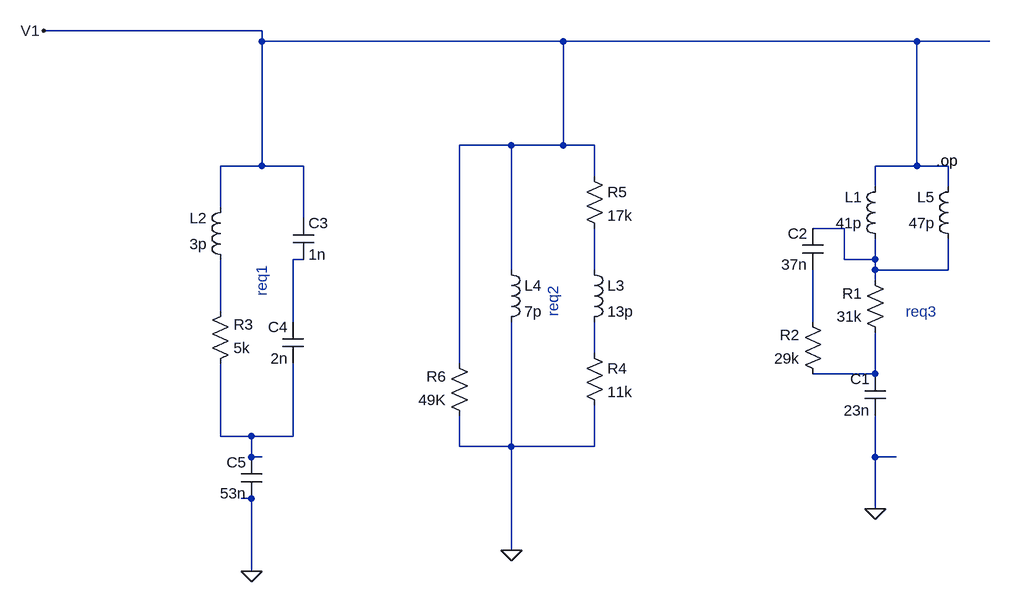
[diagram p0: schematic ejemplo 4.asc]
ejemplo 4.asc, the LTspice schematic file:
Version 4
SHEET 1 1168 680
WIRE -256 -176 -592 -176
WIRE -256 -160 -256 -176
WIRE 208 -160 -256 -160
WIRE 752 -160 208 -160
WIRE 864 -160 752 -160
WIRE 128 0 48 0
WIRE 208 0 208 -160
WIRE 208 0 128 0
WIRE 256 0 208 0
WIRE -256 32 -256 -160
WIRE -256 32 -320 32
WIRE -192 32 -256 32
WIRE 752 32 752 -160
WIRE 752 32 688 32
WIRE 800 32 752 32
WIRE 256 48 256 0
WIRE 688 64 688 32
WIRE 800 64 800 32
WIRE -320 96 -320 32
WIRE -192 112 -192 32
WIRE 640 128 592 128
WIRE -192 176 -208 176
WIRE 640 176 640 128
WIRE 688 176 688 144
WIRE 688 176 640 176
WIRE 128 192 128 0
WIRE 256 192 256 128
WIRE 688 192 688 176
WIRE 800 192 800 144
WIRE 800 192 688 192
WIRE 688 208 688 192
WIRE -320 256 -320 176
WIRE -208 272 -208 176
WIRE 592 272 592 192
WIRE 256 320 256 272
WIRE 48 336 48 0
WIRE 688 352 688 288
WIRE 688 352 592 352
WIRE -320 448 -320 336
WIRE -272 448 -320 448
WIRE -208 448 -208 336
WIRE -208 448 -272 448
WIRE 48 464 48 416
WIRE 128 464 128 272
WIRE 128 464 48 464
WIRE 256 464 256 400
WIRE 256 464 128 464
WIRE -272 480 -272 448
WIRE -256 480 -272 480
WIRE 688 480 688 416
WIRE 720 480 688 480
WIRE -272 544 -288 544
WIRE 688 560 688 480
WIRE 128 624 128 464
WIRE -272 656 -272 544
FLAG -592 -176 V1
FLAG -272 656 0
FLAG 128 624 0
FLAG 688 560 0
SYMBOL res 704 304 R180
WINDOW 0 36 76 Left 2
WINDOW 3 36 40 Left 2
SYMATTR InstName R1
SYMATTR Value 31k
SYMBOL res 608 368 R180
WINDOW 0 36 76 Left 2
WINDOW 3 36 40 Left 2
SYMATTR InstName R2
SYMATTR Value 29k
SYMBOL res -336 352 M180
WINDOW 0 36 76 Left 2
WINDOW 3 36 40 Left 2
SYMATTR InstName R3
SYMATTR Value 5k
SYMBOL res 240 304 R0
SYMATTR InstName R4
SYMATTR Value 11k
SYMBOL res 240 32 R0
SYMATTR InstName R5
SYMATTR Value 17k
SYMBOL cap 704 416 R180
WINDOW 0 24 56 Left 2
WINDOW 3 24 8 Left 2
SYMATTR InstName C1
SYMATTR Value 23n
SYMBOL cap 608 192 R180
WINDOW 0 24 56 Left 2
WINDOW 3 24 8 Left 2
SYMATTR InstName C2
SYMATTR Value 37n
SYMBOL cap -208 176 M180
WINDOW 0 24 56 Left 2
WINDOW 3 24 8 Left 2
SYMATTR InstName C3
SYMATTR Value 1n
SYMBOL cap -192 336 R180
WINDOW 0 24 56 Left 2
WINDOW 3 24 8 Left 2
SYMATTR InstName C4
SYMATTR Value 2n
SYMBOL ind 704 160 R180
WINDOW 0 36 80 Left 2
WINDOW 3 36 40 Left 2
SYMATTR InstName L1
SYMATTR Value 41p
SYMBOL ind -304 192 R180
WINDOW 0 36 80 Left 2
WINDOW 3 36 40 Left 2
SYMATTR InstName L2
SYMATTR Value 3p
SYMBOL ind 240 176 R0
SYMATTR InstName L3
SYMATTR Value 13p
SYMBOL ind 112 176 R0
SYMATTR InstName L4
SYMATTR Value 7p
SYMBOL cap -256 544 R180
WINDOW 0 24 56 Left 2
WINDOW 3 24 8 Left 2
SYMATTR InstName C5
SYMATTR Value 53n
SYMBOL res 64 432 R180
WINDOW 0 36 76 Left 2
WINDOW 3 36 40 Left 2
SYMATTR InstName R6
SYMATTR Value 49K
SYMBOL ind 816 160 R180
WINDOW 0 36 80 Left 2
WINDOW 3 36 40 Left 2
SYMATTR InstName L5
SYMATTR Value 47p
TEXT 816 24 Right 2 !.op
TEXT -256 184 VRight 2 ;req1
TEXT 192 264 VLeft 2 ;req2
TEXT 784 256 Right 2 ;req3

The netlist it stands for:
* ejemplo 4.asc
R1 N007 N001 31k
R2 N007 N005 29k
R3 N008 N004 5k
R4 N006 0 11k
R5 V1 N003 17k
C1 0 N007 23n
C2 N005 N001 37n
C3 N002 V1 1n
C4 N008 N002 2n
L1 N001 V1 41p
L2 N004 V1 3p
L3 N003 N006 13p
L4 V1 0 7p
C5 0 N008 53n
R6 0 V1 49K
L5 N001 V1 47p
.op
* req1
* req2
* req3
.backanno
.end